# EAGLE schematic BATT_CPU_TEST_BED (EAGLE 9.6.2)
COMPANY: ADAFRUIT INDUSTRIES; DRAWN: KTOWN; REV: B
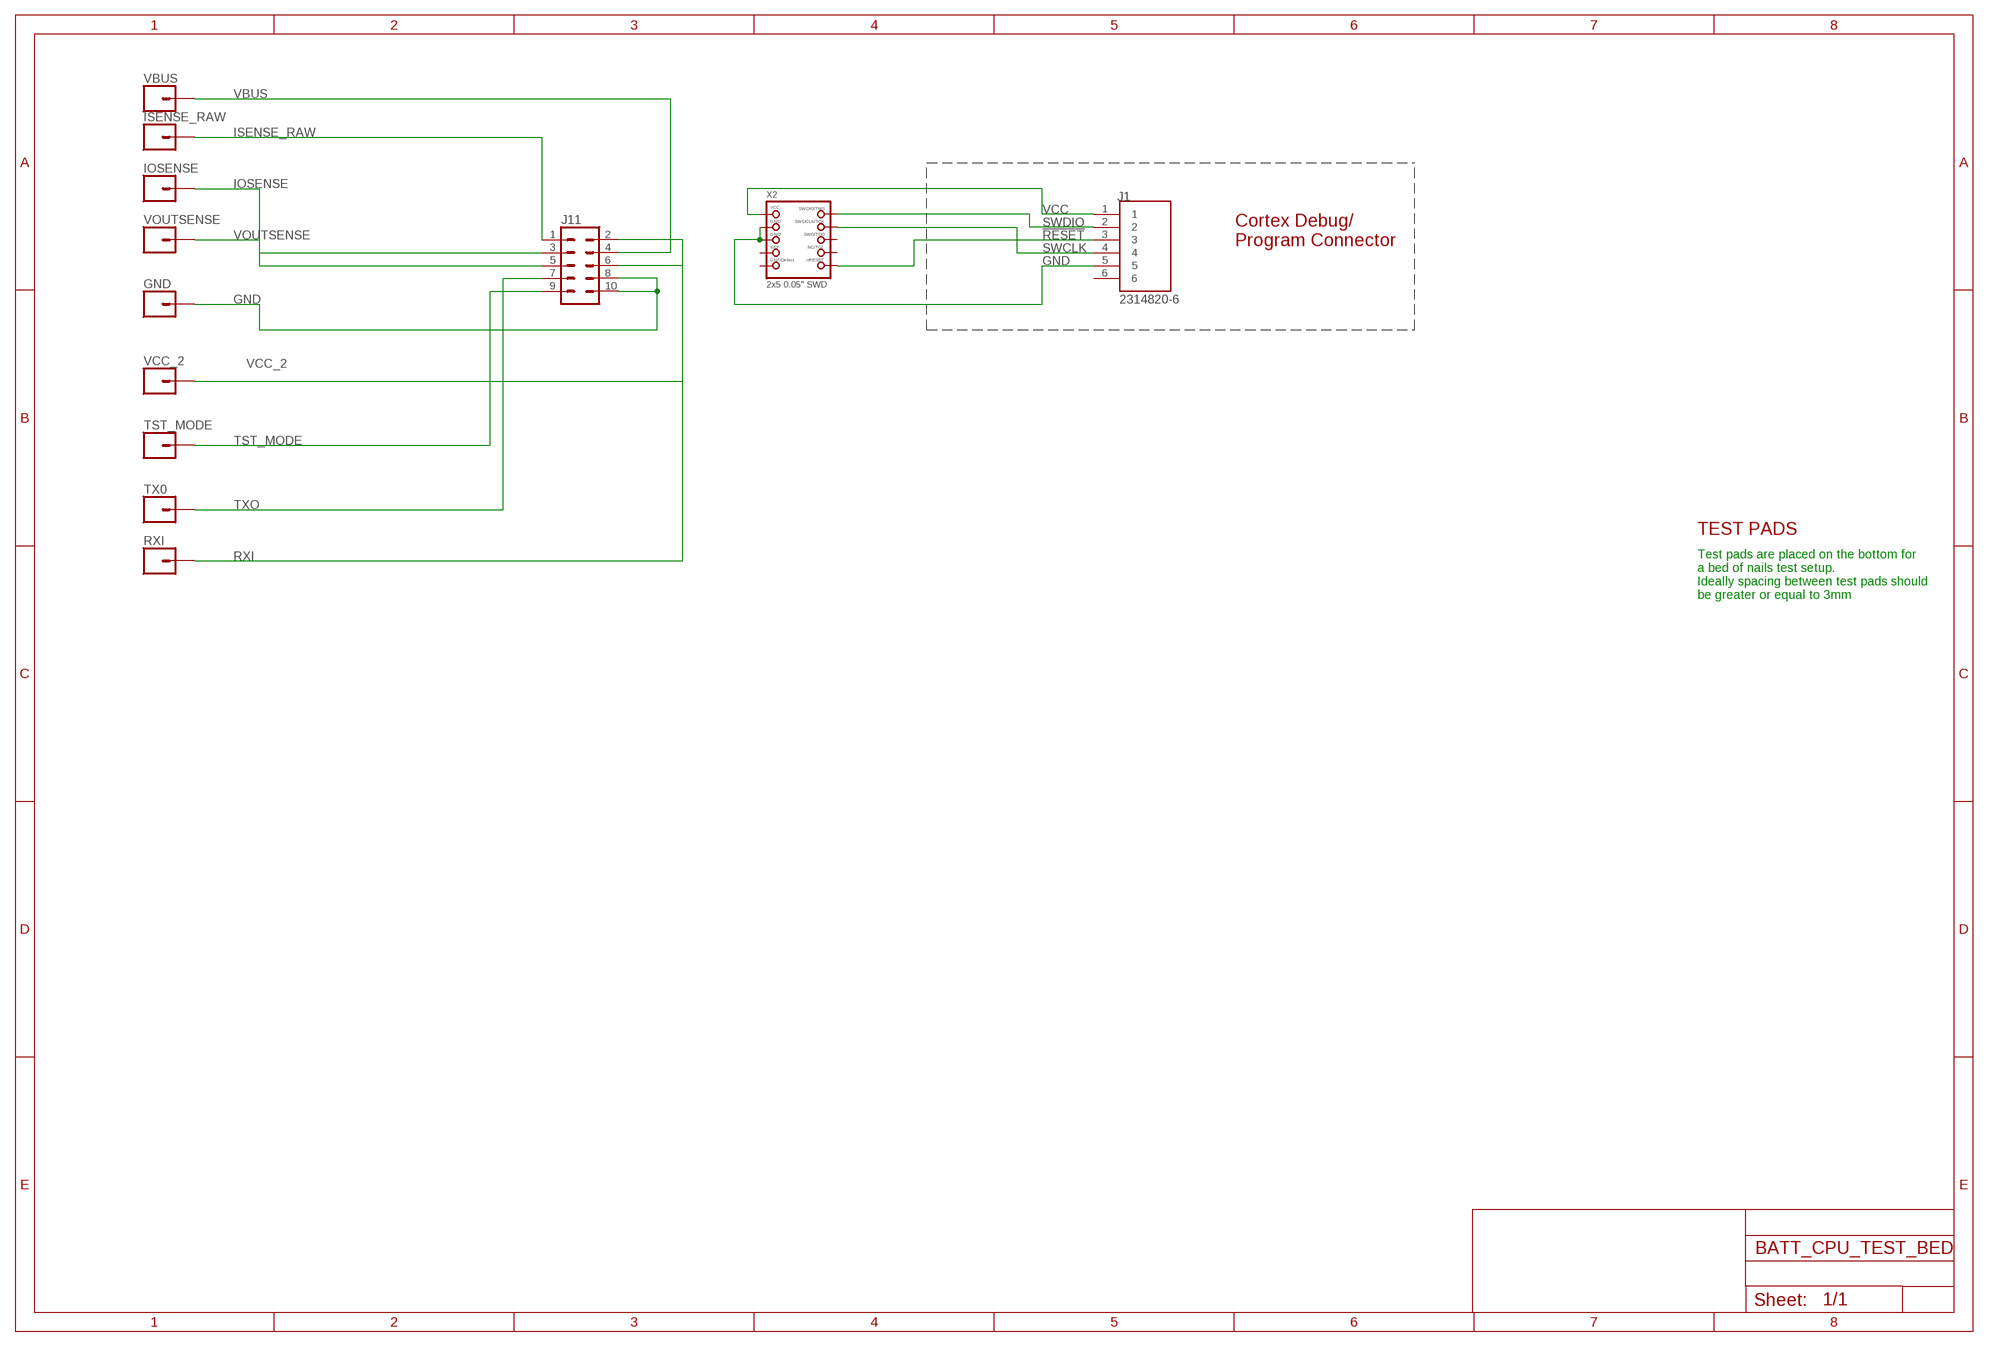
[diagram p0: schematic, sheet 1]

## Parts
GND  CONN_01POGOPIN_HOLE_LARGE  [1X01_POGOPIN_HOLE_0.061_DIA]
IOSENSE  CONN_01POGOPIN_HOLE_LARGE  [1X01_POGOPIN_HOLE_0.061_DIA]
ISENSE_RAW  CONN_01POGOPIN_HOLE_LARGE  [1X01_POGOPIN_HOLE_0.061_DIA]
J1  2314820-6  [TE_2314820-6]
J11  CONN_05X2PTH  [2X5]
RXI  CONN_01POGOPIN_HOLE_LARGE  [1X01_POGOPIN_HOLE_0.061_DIA]
TST_MODE  CONN_01POGOPIN_HOLE_LARGE  [1X01_POGOPIN_HOLE_0.061_DIA]
TX0  CONN_01POGOPIN_HOLE_LARGE  [1X01_POGOPIN_HOLE_0.061_DIA]
VBUS  CONN_01POGOPIN_HOLE_LARGE  [1X01_POGOPIN_HOLE_0.061_DIA]
VCC_2  CONN_01POGOPIN_HOLE_LARGE  [1X01_POGOPIN_HOLE_0.061_DIA]
VOUTSENSE  CONN_01POGOPIN_HOLE_LARGE  [1X01_POGOPIN_HOLE_0.061_DIA]
X2  2x5 0.05" SWD  JTAG-CORTEXBOXPOSTS  [2X05_1.27MM_BOX_POSTS]

## Nets
!RESET: J1.3 X2.10(NRESET)
GND: GND.2 J1.5 J11.8 J11.10 X2.3(GND) X2.5(GND)
IOSENSE: IOSENSE.2 J11.3
ISENSE_RAW: ISENSE_RAW.2 J11.1
RXI: J11.6 RXI.2
SWCLK: J1.4 X2.4(SWDCLK)
SWDIO: J1.2 X2.2(SWDIO)
TST_MODE: J11.9 TST_MODE.2
TXO: J11.7 TX0.2
VBUS: J11.4 VBUS.2
VCC: J1.1 X2.1(VCC)
VCC_2: J11.2 VCC_2.2
VOUTSENSE: J11.5 VOUTSENSE.2
Unconnected: J1.6 X2.6(SWO) X2.7(KEY) X2.8(TDI) X2.9(GNDDETECT)

## Notes on the sheet
- Cortex Debug/
  Program Connector
- TEST PADS
- Test pads are placed on the bottom for
  a bed of nails test setup.
  Ideally spacing between test pads should 
  be greater or equal to 3mm

## Library data of the parts
GND IOSENSE ISENSE_RAW RXI TST_MODE TX0 VBUS VCC_2 VOUTSENSE = SparkFun-Connectors:CONN_01: Single connection point. Often used as Generic Header-pin footprint for 0.1 inch spaced/style header connections On any of the 0.1 inch spaced packages, you can populate with these: Break Away Headers - Straight <https://www.sparkfun.com/products/116> (PRT-00116) Break Away Male Headers - Right Angle <https://www.sparkfun.com/products/553> (PRT-00553) Female Headers <https://www.sparkfun.com/products/115> (PRT-00115) Break Away Headers - Machine Pin <https://www.sparkfun.com/products/117> (PRT-00117) Break Away Female Headers - Swiss Machine Pin <https://www.sparkfun.com/products/743> (PRT-00743) This device is also useful as a general connection point to wire up your design to another part of your project. Our various solder wires solder well into these plated through hole pads. Hook-Up Wire - Assortment (Stranded, 22 AWG) <https://www.sparkfun.com/products/11375> (PRT-11375) Hook-Up Wire - Assortment (Solid Core, 22 AWG) <https://www.sparkfun.com/products/11367> (PRT-11367) View the entire wire category on our website here <https://www.sparkfun.com/categories/141> Special notes: SMTSO-256-ET is a "flush mount" nut for a 4-40 screw. We mostly use this on specialty testbeds; it is a nice way to connect hardware to your PCB at an adjustable hieght. Also note, the SNAP packages are for using a snappable style connector. We sell a baggie of snaps and they are also used on two LilyPad designs: Snap Assortment - 30 pack (male and female) <https://www.sparkfun.com/products/11347> (DEV-11347) LilyPad Arduino SimpleSnap <https://www.sparkfun.com/products/10941> (DEV-10941) LilyPad SimpleSnap Protoboard <https://www.sparkfun.com/products/10940> (DEV-10940)
J1 = connector 2x3-2mm:2314820-6; COMMENT: 2314820-6; DESCRIPTION: Socket Receptacle 6P,2MM,B-B,REC,DRVT,2.7,0.1AU,TB 6 POS; DIGI-KEY_PART_NUMBER: 17-2314820-6-ND; MF: TE Connectivity; MP: 2314820-6; PACKAGE: None; PURCHASE-URL: https://pricing.snapeda.com/search/part/2314820-6/?ref=eda
J11 = SparkFun-Connectors:CONN_05X2: Multi connection point. Often used as Generic Header-pin footprint for 0.1 inch spaced/style header connections For AVR SPI programming port, see special device with nice symbol: "AVR_SPI_PROG_5x2.dev" You can populate with any combo of single row headers, but if you'd like an exact match, check these: 2x5 AVR ICSP Male Header <https://www.sparkfun.com/products/778> (PRT-00778) 2x5 Pin Shrouded Header <https://www.sparkfun.com/products/8506> (PRT-08506) On any of the 0.1 inch spaced packages, you can populate with these: Break Away Headers - Straight <https://www.sparkfun.com/products/116> (PRT-00116) Break Away Male Headers - Right Angle <https://www.sparkfun.com/products/553> (PRT-00553) Female Headers <https://www.sparkfun.com/products/115> (PRT-00115) Break Away Headers - Machine Pin <https://www.sparkfun.com/products/117> (PRT-00117) Break Away Female Headers - Swiss Machine Pin <https://www.sparkfun.com/products/743> (PRT-00743) Special note: the shrouded connector mates well with our 5x2 ribbon cables: 2x5 Pin IDC Ribbon Cable <https://www.sparkfun.com/products/8535> (PRT-08535); PROD_ID: CONN-08499; SF_ID: PRT-0778
X2 = microbuilder:JTAG-CORTEX: Serial Wire (SW-DP) Connector Standard 0.05" 10-pin connector is for use with the Cortex M and Cortex A SWD (serial wire debugger) interface (SW-DP) Connectors 2x05_1.27MM_SMT - Inexpensive surface-mount header with bare pins, compatible with standard 10-pin SWD cables (4UCON: 16846) 2x05_1.27MM_BOX_NOPOSTS - Polarised surface-mount box (4UCON with caps: 19735, without caps: 15117 2x05_1.27MM_BOX_POSTS - Polarised surface-mount box with mounting holes (4UCON: 20317) Pinout: http://infocenter.arm.com/help/topic/com.arm.doc.faqs/attached/13634/cortex_debug_connectors.pdf http://www.keil.com/peripherals/coresight/connectors.asp

## Net classes
2 gnd: width 0.305 mm, drill 0.483 mm, clearance 0.203 mm